# Altium schematic sheet IOTM222.SchDoc
size A4; DocumentNumber: 1; SheetNumber: 1; SheetTotal: 1
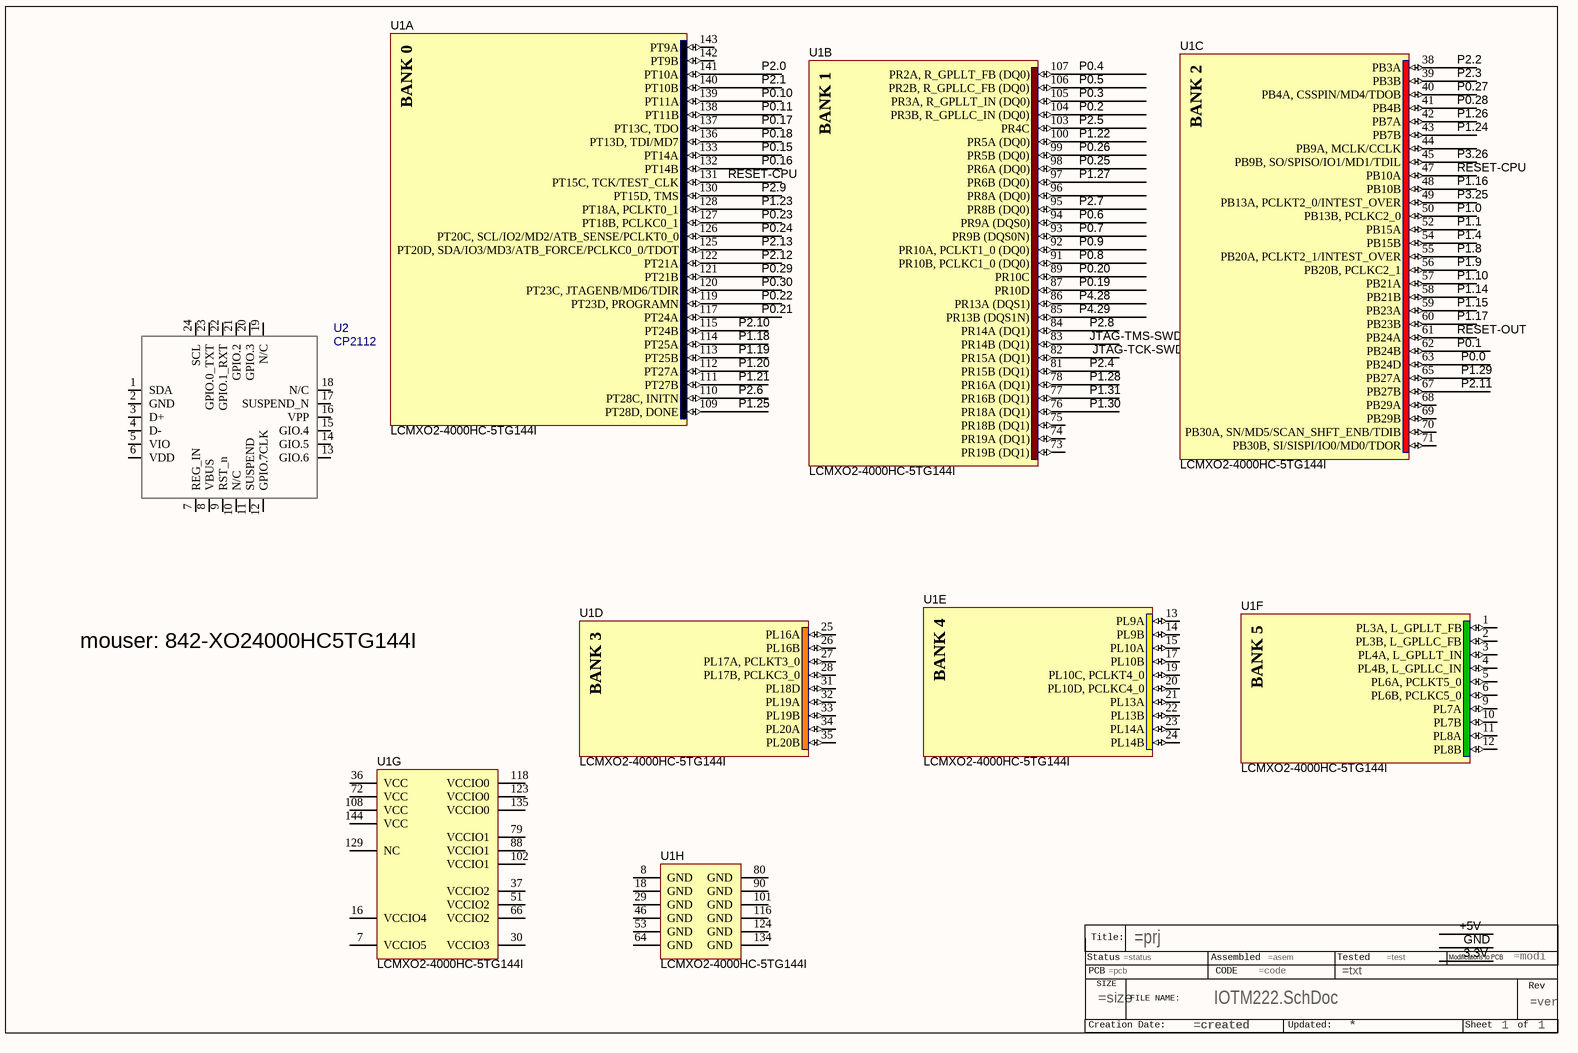
[diagram p0: IOTM222.SchDoc]

## Parts
?*  FILE_NAME: IOTM222.SchDoc  PAGE NUMPER: 1  (hidden comment: TITLEBLOCK2)  (graphical)
U1  LCMXO2-4000HC-5TG144I  [TQFP144_N]  (parts A,B,C,D,E,F,G,H of 8)
U2  CP2112  [QFN24]

## Nets
JTAG-TCK-SWDCLK: U1.82(PR15A_(DQ1))
JTAG-TMS-SWDIO: U1.83(PR14B_(DQ1))
P0.0: U1.63(PB24D)
P0.1: U1.62(PB24B)
P0.2: U1.104(PR3B,_R_GPLLC_IN_(DQ0))
P0.3: U1.105(PR3A,_R_GPLLT_IN_(DQ0))
P0.4: U1.107(PR2A,_R_GPLLT_FB_(DQ0))
P0.5: U1.106(PR2B,_R_GPLLC_FB_(DQ0))
P0.6: U1.94(PR9A_(DQS0))
P0.7: U1.93(PR9B_(DQS0N))
P0.8: U1.91(PR10B,_PCLKC1_0_(DQ0))
P0.9: U1.92(PR10A,_PCLKT1_0_(DQ0))
P0.10: U1.139(PT11A)
P0.11: U1.138(PT11B)
P0.15: U1.133(PT14A)
P0.16: U1.132(PT14B)
P0.17: U1.137(PT13C,_TDO)
P0.18: U1.136(PT13D,_TDI/MD7)
P0.19: U1.87(PR10D)
P0.20: U1.89(PR10C)
P0.21: U1.117(PT24A)
P0.22: U1.119(PT23D,_PROGRAMN)
P0.23: U1.127(PT18B,_PCLKC0_1)
P0.24: U1.126(PT20C,_SCL/IO2/MD2/ATB_SENSE/PCLKT0_0)
P0.25: U1.98(PR6A_(DQ0))
P0.26: U1.99(PR5B_(DQ0))
P0.27: U1.40(PB4A,_CSSPIN/MD4/TDOB)
P0.28: U1.41(PB4B)
P0.29: U1.121(PT21B)
P0.30: U1.120(PT23C,_JTAGENB/MD6/TDIR)
P1.0: U1.50(PB13B,_PCLKC2_0)
P1.1: U1.52(PB15A)
P1.4: U1.54(PB15B)
P1.8: U1.55(PB20A,_PCLKT2_1/INTEST_OVER)
P1.9: U1.56(PB20B,_PCLKC2_1)
P1.10: U1.57(PB21A)
P1.14: U1.58(PB21B)
P1.15: U1.59(PB23A)
P1.16: U1.48(PB10B)
P1.17: U1.60(PB23B)
P1.18: U1.114(PT25A)
P1.19: U1.113(PT25B)
P1.20: U1.112(PT27A)
P1.21: U1.111(PT27B)
P1.22: U1.100(PR5A_(DQ0))
P1.23: U1.128(PT18A,_PCLKT0_1)
P1.24: U1.43(PB7B)
P1.25: U1.109(PT28D,_DONE)
P1.26: U1.42(PB7A)
P1.27: U1.97(PR6B_(DQ0))
P1.28: U1.78(PR16A_(DQ1))
P1.29: U1.65(PB27A)
P1.30: U1.76(PR18A_(DQ1))
P1.31: U1.77(PR16B_(DQ1))
P2.0: U1.141(PT10A)
P2.1: U1.140(PT10B)
P2.2: U1.38(PB3A)
P2.3: U1.39(PB3B)
P2.4: U1.81(PR15B_(DQ1))
P2.5: U1.103(PR4C)
P2.6: U1.110(PT28C,_INITN)
P2.7: U1.95(PR8B_(DQ0))
P2.8: U1.84(PR14A_(DQ1))
P2.9: U1.130(PT15D,_TMS)
P2.10: U1.115(PT24B)
P2.11: U1.67(PB27B)
P2.12: U1.122(PT21A)
P2.13: U1.125(PT20D,_SDA/IO3/MD3/ATB_FORCE/PCLKC0_0/TDOT)
P3.25: U1.49(PB13A,_PCLKT2_0/INTEST_OVER)
P3.26: U1.45(PB9B,_SO/SPISO/IO1/MD1/TDIL)
P4.28: U1.86(PR13A_(DQS1))
P4.29: U1.85(PR13B_(DQS1N))
RESET-CPU: U1.47(PB10A) U1.131(PT15C,_TCK/TEST_CLK)
RESET-OUT: U1.61(PB24A)

Not connected (* = marked no-connect by the designer): ?* ?1; U1 1(PL3A,_L_GPLLT_FB) 2(PL3B,_L_GPLLC_FB) 3(PL4A,_L_GPLLT_IN) 4(PL4B,_L_GPLLC_IN) 5(PL6A,_PCLKT5_0) 6(PL6B,_PCLKC5_0) 7(VCCIO5) 8(GND) 9(PL7A) 10(PL7B) 11(PL8A) 12(PL8B) 13(PL9A) 14(PL9B) 15(PL10A) 16(VCCIO4) 17(PL10B) 18(GND) 19(PL10C,_PCLKT4_0) 20(PL10D,_PCLKC4_0) 21(PL13A) 22(PL13B) 23(PL14A) 24(PL14B) 25(PL16A) 26(PL16B) 27(PL17A,_PCLKT3_0) 28(PL17B,_PCLKC3_0) 29(GND) 30(VCCIO3) 31(PL18D) 32(PL19A) 33(PL19B) 34(PL20A) 35(PL20B) 36(VCC) 37(VCCIO2) 44(PB9A,_MCLK/CCLK) 46(GND) 51(VCCIO2) 53(GND) 64(GND) 66(VCCIO2) 68(PB29A) 69(PB29B) 70(PB30A,_SN/MD5/SCAN_SHFT_ENB/TDIB) 71(PB30B,_SI/SISPI/IO0/MD0/TDOR) 72(VCC) 73(PR19B_(DQ1)) 74(PR19A_(DQ1)) 75(PR18B_(DQ1)) 79(VCCIO1) 80(GND) 88(VCCIO1) 90(GND) 96(PR8A_(DQ0)) 101(GND) 102(VCCIO1) 108(VCC) 116(GND) 118(VCCIO0) 123(VCCIO0) 124(GND) 129(NC) 134(GND) 135(VCCIO0) 142(PT9B) 143(PT9A) 144(VCC); U2 1(SDA) 2(GND) 3(D+) 4(D-) 5(VIO) 6(VDD) 7(REG_IN) 8(VBUS) 9(RST_n) 10(N/C) 11(SUSPEND) 12(GPIO.7CLK) 13(GIO.6) 14(GIO.5) 15(GIO.4) 16(VPP) 17(SUSPEND_N) 18(N/C) 19(N/C) 20(GPIO.3) 21(GPIO.2) 22(GPIO.1_RXT) 23(GPIO.0_TXT) 24(SCL)

## Notes on the sheet
- mouser: 842-XO24000HC5TG144I
- (in symbol LCMXO2-4000HC-5TG144I, part A) BANK 0
- (in symbol LCMXO2-4000HC-5TG144I, part B) BANK 1
- (in symbol LCMXO2-4000HC-5TG144I, part C) BANK 2
- (in symbol LCMXO2-4000HC-5TG144I, part D) BANK 3
- (in symbol LCMXO2-4000HC-5TG144I, part E) BANK 4
- (in symbol LCMXO2-4000HC-5TG144I, part F) BANK 5
- (in symbol TITLEBLOCK2) Title:; Status; Assembled; Tested; Modifications to PCB; PCB; CODE; SIZE; Rev; FILE NAME:; Creation Date:; Updated:; Sheet; of

## Library data of the parts
U1 = LCMXO2-4000HC-5TG144I: MachXO2 High Performance CPLD with 4320 LUTs, Voltage Regulator, 2.5V/3.3V, 144-pin TQFP, Speed Grade-5, Industrial Grade, Halogen Free (RoHS); DatasheetVersion: ver01.5, Aug-2011; PackageVersion: ver02.8, Jul-2011; PackageReference: TQFP144; PackageDescription: 144-Pin Thin Quad Flat Pack (TQFP144); Code_JEDEC: MS-026-BFB; ComponentLink1Description: Manufacturer URL; ComponentLink1URL: http://www.latticesemi.com/; ComponentLink2Description: Datasheet; ComponentLink2URL: http://www.latticesemi.com/documents/DS1035.pdf; ComponentLink3Description: Package Specification; ComponentLink3URL: http://www.latticesemi.com/lit/docs/package/pkg.pdf
?* = TITLEBLOCK2: CREATION DATE: =created; UPDATED: *; PAGE COUNT: 1; size: =size; VERSION: =ver; pr: =prj; ASSEMBLY: =asem; MODIFICATIONS TO OPERATE: =modi; TESTED: =test; PCB: =pcb; STATUS: =status; CODE: =code; TEXT: =txt